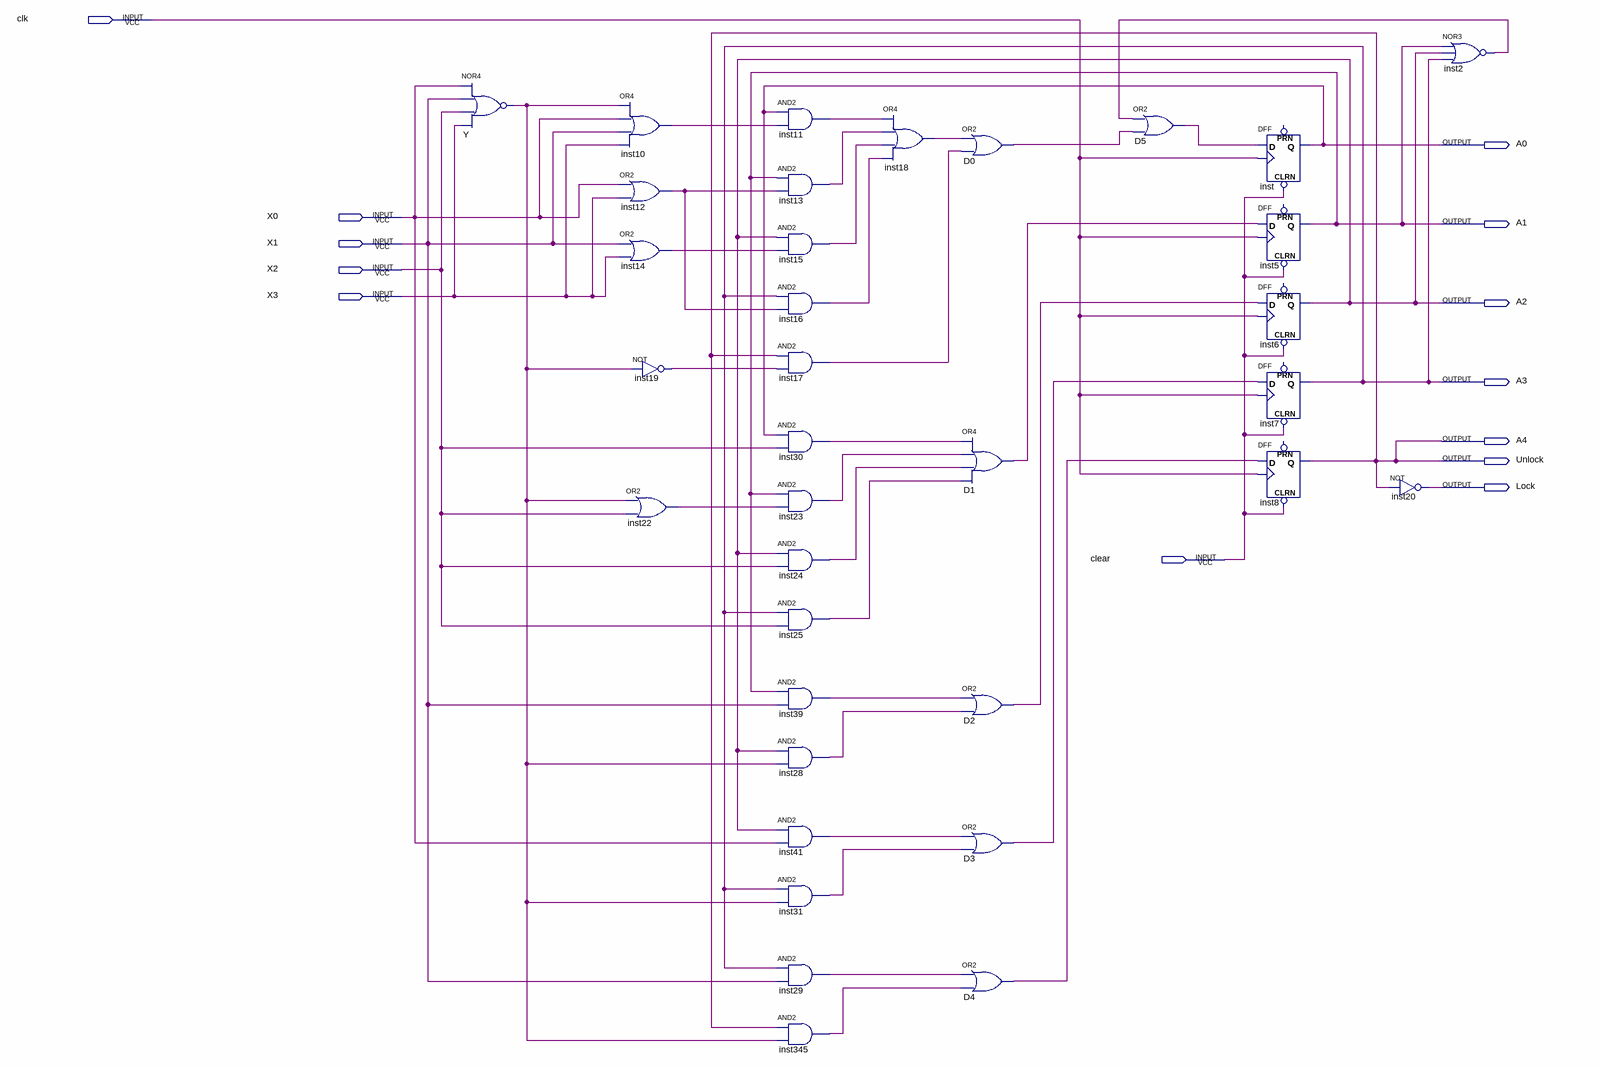
[diagram p0: schematic sheet]
// Quartus schematic Lab02_B0729008.bdf as structural Verilog: 35 symbols, 13 pins
module Lab02_B0729008 (
  input  clk,
  input  X0,
  input  X1,
  input  X2,
  input  X3,
  input  clear,
  output A0,
  output A1,
  output A2,
  output A3,
  output A4,
  output Unlock,
  output Lock
);

  wire D0_out, D1_out, D2_out, D3_out, D4_out, D5_out, inst2_out, inst10_out, inst11_out, inst12_out,
       inst13_out, inst14_out, inst15_out, inst16_out, inst17_out, inst18_out, inst19_out, inst22_out,
       inst23_out, inst24_out, inst25_out, inst28_out, inst29_out, inst30_out, inst31_out, inst39_out,
       inst41_out, inst345_out, Y_out;

  nor Y (Y_out, X0, X1, X2, X3);
  or inst10 (inst10_out, Y_out, X0, X1, X3);
  or inst12 (inst12_out, X0, X3);
  or inst14 (inst14_out, X1, X3);
  or inst22 (inst22_out, Y_out, X2);
  not inst19 (inst19_out, Y_out);
  and inst11 (inst11_out, A0, inst10_out);
  and inst13 (inst13_out, A1, inst12_out);
  and inst15 (inst15_out, A2, inst14_out);
  and inst16 (inst16_out, A3, inst12_out);
  and inst17 (inst17_out, A4, inst19_out);
  and inst30 (inst30_out, A0, X2);
  and inst23 (inst23_out, A1, inst22_out);
  and inst24 (inst24_out, A2, X2);
  and inst25 (inst25_out, A3, X2);
  and inst39 (inst39_out, A1, X1);
  and inst28 (inst28_out, A2, Y_out);
  and inst41 (inst41_out, A2, X0);
  and inst31 (inst31_out, A3, Y_out);
  and inst29 (inst29_out, A3, X1);
  and inst345 (inst345_out, A4, Y_out);
  or inst18 (inst18_out, inst11_out, inst13_out, inst15_out, inst16_out);
  or D0 (D0_out, inst18_out, inst17_out);
  or D1 (D1_out, inst30_out, inst23_out, inst24_out, inst25_out);
  or D2 (D2_out, inst39_out, inst28_out);
  or D3 (D3_out, inst41_out, inst31_out);
  or D4 (D4_out, inst29_out, inst345_out);
  or D5 (D5_out, inst2_out, D0_out);
  DFF inst (.CLRN(clear), .CLK(clk), .D(D5_out), .Q(A0));  // open: PRN
  DFF inst5 (.CLRN(clear), .CLK(clk), .D(D1_out), .Q(A1));  // open: PRN
  DFF inst6 (.CLRN(clear), .CLK(clk), .D(D2_out), .Q(A2));  // open: PRN
  DFF inst7 (.CLRN(clear), .CLK(clk), .D(D3_out), .Q(A3));  // open: PRN
  DFF inst8 (.CLRN(clear), .CLK(clk), .D(D4_out), .Q(A4));  // open: PRN
  not inst20 (Lock, A4);
  nor inst2 (inst2_out, A1, A2, A3);

  assign Unlock = A4;
endmodule
